# Altium schematic sheet JoyStickAdcInput.SchDoc
size A4
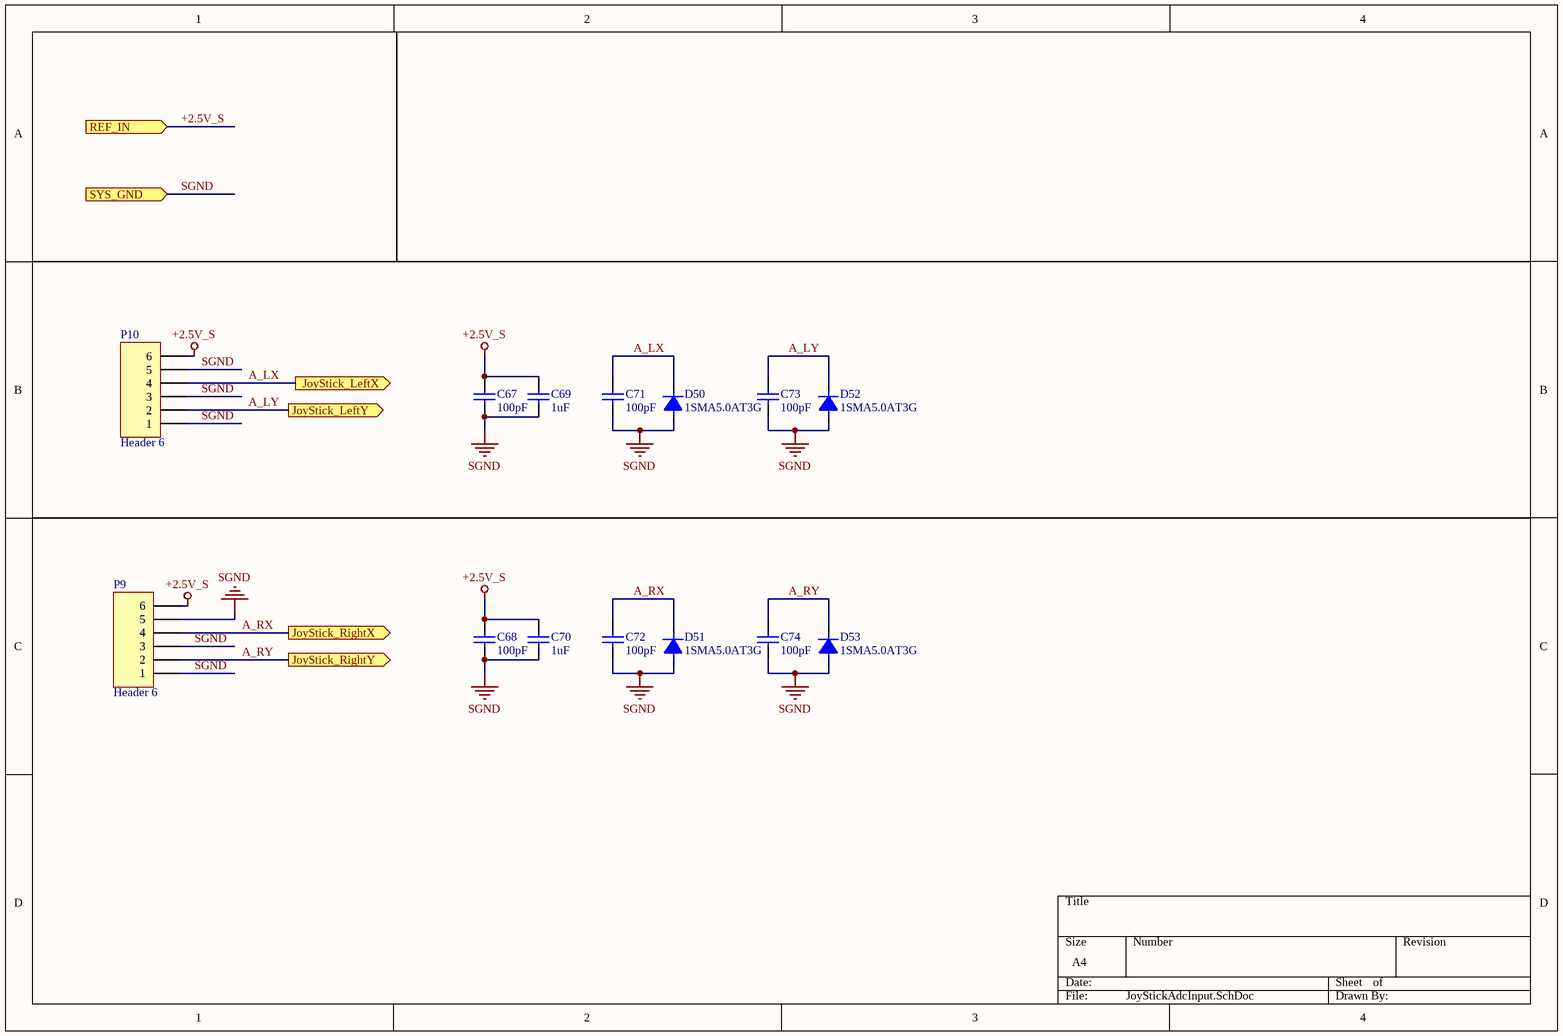
[diagram p0: JoyStickAdcInput.SchDoc]

## Parts
C67  100pF  [C0805]
C68  100pF  [C0805]
C69  1uF  [C0805]
C70  1uF  [C0805]
C71  100pF  [C0805]
C72  100pF  [C0805]
C73  100pF  [C0805]
C74  100pF  [C0805]
D50  1SMA5.0AT3G  [SMA]
D51  1SMA5.0AT3G  [SMA]
D52  1SMA5.0AT3G  [SMA]
D53  1SMA5.0AT3G  [SMA]
P9  Header 6  [FFC/SM1.0-6]
P10  Header 6  [FFC/SM1.0-6]

## Ports
JoyStick_LeftX (out), JoyStick_LeftY (out), JoyStick_RightX (out), JoyStick_RightY (out), REF_IN (in), SYS_GND (in)

## Nets
+2.5V_S: C67.1 C68.1 C69.1 C70.1 P9.6 P10.6 ; port REF_IN
SGND: C67.2 C68.2 C69.2 C70.2 C71.2 C72.2 C73.2 C74.2 D50.1(A) D51.1(A) D52.1(A) D53.1(A) P9.1 P9.3 P9.5 P10.1 P10.3 P10.5 ; port SYS_GND
A_LX: C71.1 D50.2(K) P10.4 ; port JoyStick_LeftX
A_LY: C73.1 D52.2(K) P10.2 ; port JoyStick_LeftY
A_RX: C72.1 D51.2(K) P9.4 ; port JoyStick_RightX
A_RY: C74.1 D53.2(K) P9.2 ; port JoyStick_RightY

## Library data of the parts
C67-C74 = Cap: Capacitor; Value: 22pF; Published: 8-Jun-2000; Revision: July-2002: Re-released for DXP Platform.; Publisher: Altium Limited
D50-D53 = DIODE1: Diode
P9 P10 = Header 6: Header, 6-Pin; LatestRevisionDate: 17-Jul-2002; LatestRevisionNote: Re-released for DXP Platform.; Publisher: Altium Limited